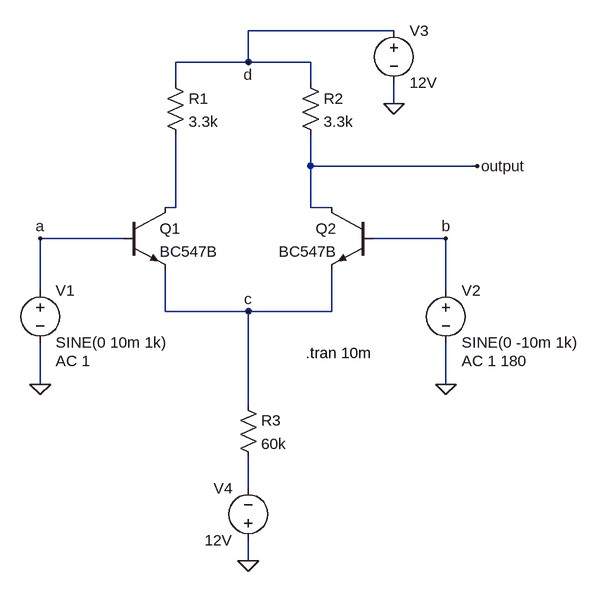
[diagram p0: schematic 1st_stage_preamp.asc]
1st_stage_preamp.asc, the LTspice schematic file:
Version 4
SHEET 1 944 680
WIRE 640 -272 416 -272
WIRE 416 -224 416 -272
WIRE 416 -224 304 -224
WIRE 512 -224 416 -224
WIRE 304 -192 304 -224
WIRE 512 -192 512 -224
WIRE 640 -160 640 -192
WIRE 512 -64 512 -112
WIRE 768 -64 512 -64
WIRE 304 0 304 -112
WIRE 304 0 288 0
WIRE 512 0 512 -64
WIRE 544 0 512 0
WIRE 224 48 96 48
WIRE 720 48 608 48
WIRE 96 128 96 48
WIRE 720 128 720 48
WIRE 288 160 288 96
WIRE 416 160 288 160
WIRE 544 160 544 96
WIRE 544 160 416 160
WIRE 96 272 96 208
WIRE 720 272 720 208
WIRE 416 304 416 160
WIRE 416 432 416 384
WIRE 416 544 416 512
FLAG 96 272 0
FLAG 720 272 0
FLAG 640 -160 0
FLAG 416 544 0
FLAG 96 48 a
FLAG 720 48 b
FLAG 416 160 c
FLAG 416 -224 d
FLAG 768 -64 output
SYMBOL voltage 96 112 R0
WINDOW 123 24 124 Left 2
WINDOW 39 0 0 Left 0
SYMATTR Value2 AC 1
SYMATTR InstName V1
SYMATTR Value SINE(0 10m 1k)
SYMBOL voltage 720 112 R0
WINDOW 123 24 124 Left 2
WINDOW 39 0 0 Left 0
SYMATTR Value2 AC 1 180
SYMATTR InstName V2
SYMATTR Value SINE(0 -10m 1k)
SYMBOL res 288 -208 R0
SYMATTR InstName R1
SYMATTR Value 3.3k
SYMBOL res 496 -208 R0
SYMATTR InstName R2
SYMATTR Value 3.3k
SYMBOL res 400 288 R0
SYMATTR InstName R3
SYMATTR Value 60k
SYMBOL npn 224 0 R0
SYMATTR InstName Q1
SYMATTR Value BC547B
SYMBOL npn 608 0 M0
SYMATTR InstName Q2
SYMATTR Value BC547B
SYMBOL voltage 640 -288 R0
WINDOW 123 0 0 Left 0
WINDOW 39 0 0 Left 0
SYMATTR InstName V3
SYMATTR Value 12V
SYMBOL voltage 416 528 R180
WINDOW 0 24 96 Left 2
WINDOW 3 24 16 Left 2
WINDOW 123 0 0 Left 0
WINDOW 39 0 0 Left 0
SYMATTR InstName V4
SYMATTR Value 12V
TEXT 504 224 Left 2 !.tran 10m

The netlist it stands for:
* 1st_stage_preamp.asc
V1 a 0 SINE(0 10m 1k) AC 1
V2 b 0 SINE(0 -10m 1k) AC 1 180
R1 d N001 3.3k
R2 d output 3.3k
R3 c N002 60k
Q1 N001 a c 0 BC547B
Q2 output b c 0 BC547B
V3 d 0 12V
V4 0 N002 12V
.model NPN NPN
.model PNP PNP
.lib standard.bjt
.tran 10m
.backanno
.end